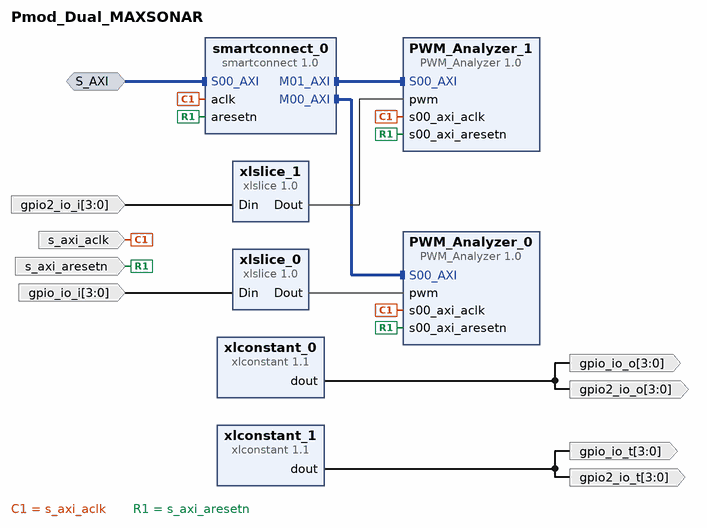
[diagram p0: block diagram of the top level]
# Vivado block design Pmod_Dual_MAXSONAR, xc7a100tcsg324-1, Vivado 2024.2
create_bd_design Pmod_Dual_MAXSONAR

create_bd_intf_port -mode Slave -vlnv xilinx.com:interface:aximm_rtl:1.0 S_AXI
set_property -dict [list \
  CONFIG.ADDR_WIDTH 32 \
  CONFIG.ARUSER_WIDTH 0 \
  CONFIG.AWUSER_WIDTH 0 \
  CONFIG.BUSER_WIDTH 0 \
  CONFIG.DATA_WIDTH 32 \
  CONFIG.HAS_BRESP 1 \
  CONFIG.HAS_BURST 1 \
  CONFIG.HAS_CACHE 1 \
  CONFIG.HAS_LOCK 1 \
  CONFIG.HAS_PROT 1 \
  CONFIG.HAS_QOS 1 \
  CONFIG.HAS_REGION 1 \
  CONFIG.HAS_RRESP 1 \
  CONFIG.HAS_WSTRB 1 \
  CONFIG.ID_WIDTH 0 \
  CONFIG.MAX_BURST_LENGTH 256 \
  CONFIG.NUM_READ_OUTSTANDING 1 \
  CONFIG.NUM_READ_THREADS 1 \
  CONFIG.NUM_WRITE_OUTSTANDING 1 \
  CONFIG.NUM_WRITE_THREADS 1 \
  CONFIG.PROTOCOL AXI4 \
  CONFIG.READ_WRITE_MODE READ_WRITE \
  CONFIG.RUSER_BITS_PER_BYTE 0 \
  CONFIG.RUSER_WIDTH 0 \
  CONFIG.SUPPORTS_NARROW_BURST 1 \
  CONFIG.WUSER_BITS_PER_BYTE 0 \
  CONFIG.WUSER_WIDTH 0 \
] [get_bd_intf_ports S_AXI]
create_bd_port -dir I -type clk s_axi_aclk
create_bd_port -dir I -type rst s_axi_aresetn
create_bd_port -dir I -from 3 -to 0 gpio_io_i
create_bd_port -dir I -from 3 -to 0 gpio2_io_i
create_bd_port -dir O -from 3 -to 0 gpio_io_o
create_bd_port -dir O -from 3 -to 0 gpio_io_t
create_bd_port -dir O -from 3 -to 0 gpio2_io_o
create_bd_port -dir O -from 3 -to 0 gpio2_io_t

create_bd_cell -type ip -vlnv xilinx.com:ip:smartconnect:1.0 smartconnect_0
set_property -dict {CONFIG.NUM_MI 2 CONFIG.NUM_SI 1} [get_bd_cells smartconnect_0]
create_bd_cell -type ip -vlnv digilentinc.com:IP:PWM_Analyzer:1.0 PWM_Analyzer_0
create_bd_cell -type ip -vlnv digilentinc.com:IP:PWM_Analyzer:1.0 PWM_Analyzer_1
create_bd_cell -type ip -vlnv xilinx.com:ip:xlslice:1.0 xlslice_0
set_property -dict {CONFIG.DIN_FROM 3 CONFIG.DIN_TO 3 CONFIG.DIN_WIDTH 4} [get_bd_cells xlslice_0]
create_bd_cell -type ip -vlnv xilinx.com:ip:xlslice:1.0 xlslice_1
set_property -dict {CONFIG.DIN_FROM 3 CONFIG.DIN_TO 3 CONFIG.DIN_WIDTH 4} [get_bd_cells xlslice_1]
create_bd_cell -type ip -vlnv xilinx.com:ip:xlconstant:1.1 xlconstant_0
set_property -dict {CONFIG.CONST_VAL 0 CONFIG.CONST_WIDTH 4} [get_bd_cells xlconstant_0]
create_bd_cell -type ip -vlnv xilinx.com:ip:xlconstant:1.1 xlconstant_1
set_property -dict {CONFIG.CONST_VAL 15 CONFIG.CONST_WIDTH 4} [get_bd_cells xlconstant_1]

# ---- connections ----

connect_bd_intf_net -intf_net S_AXI_0_1 [get_bd_intf_ports S_AXI] [get_bd_intf_pins smartconnect_0/S00_AXI]
connect_bd_intf_net [get_bd_intf_pins smartconnect_0/M00_AXI] [get_bd_intf_pins PWM_Analyzer_0/S00_AXI]
connect_bd_intf_net [get_bd_intf_pins smartconnect_0/M01_AXI] [get_bd_intf_pins PWM_Analyzer_1/S00_AXI]
connect_bd_net -net Din_0_1 [get_bd_ports gpio_io_i] [get_bd_pins xlslice_0/Din]
connect_bd_net -net Din_0_2 [get_bd_ports gpio2_io_i] [get_bd_pins xlslice_1/Din]
connect_bd_net -net s_axi_aclk_0_1 [get_bd_ports s_axi_aclk] \
  [get_bd_pins smartconnect_0/aclk] [get_bd_pins PWM_Analyzer_0/s00_axi_aclk] [get_bd_pins PWM_Analyzer_1/s00_axi_aclk]
connect_bd_net -net s_axi_aresetn_0_1 [get_bd_ports s_axi_aresetn] \
  [get_bd_pins smartconnect_0/aresetn] [get_bd_pins PWM_Analyzer_1/s00_axi_aresetn] \
  [get_bd_pins PWM_Analyzer_0/s00_axi_aresetn]
connect_bd_net [get_bd_pins xlconstant_0/dout] [get_bd_ports gpio_io_o] [get_bd_ports gpio2_io_o]
connect_bd_net [get_bd_pins xlconstant_1/dout] [get_bd_ports gpio_io_t] [get_bd_ports gpio2_io_t]
connect_bd_net [get_bd_pins xlslice_0/Dout] [get_bd_pins PWM_Analyzer_0/pwm]
connect_bd_net [get_bd_pins xlslice_1/Dout] [get_bd_pins PWM_Analyzer_1/pwm]

# ---- address map ----
assign_bd_address -offset 0x44A00000 -range 64K -target_address_space [get_bd_addr_spaces S_AXI] [get_bd_addr_segs PWM_Analyzer_0/S00_AXI/S00_AXI_reg]
assign_bd_address -offset 0x44A10000 -range 64K -target_address_space [get_bd_addr_spaces S_AXI] [get_bd_addr_segs PWM_Analyzer_1/S00_AXI/S00_AXI_reg]

validate_bd_design
save_bd_design
